# EAGLE design rs232_usb (EAGLE 6.5.0)
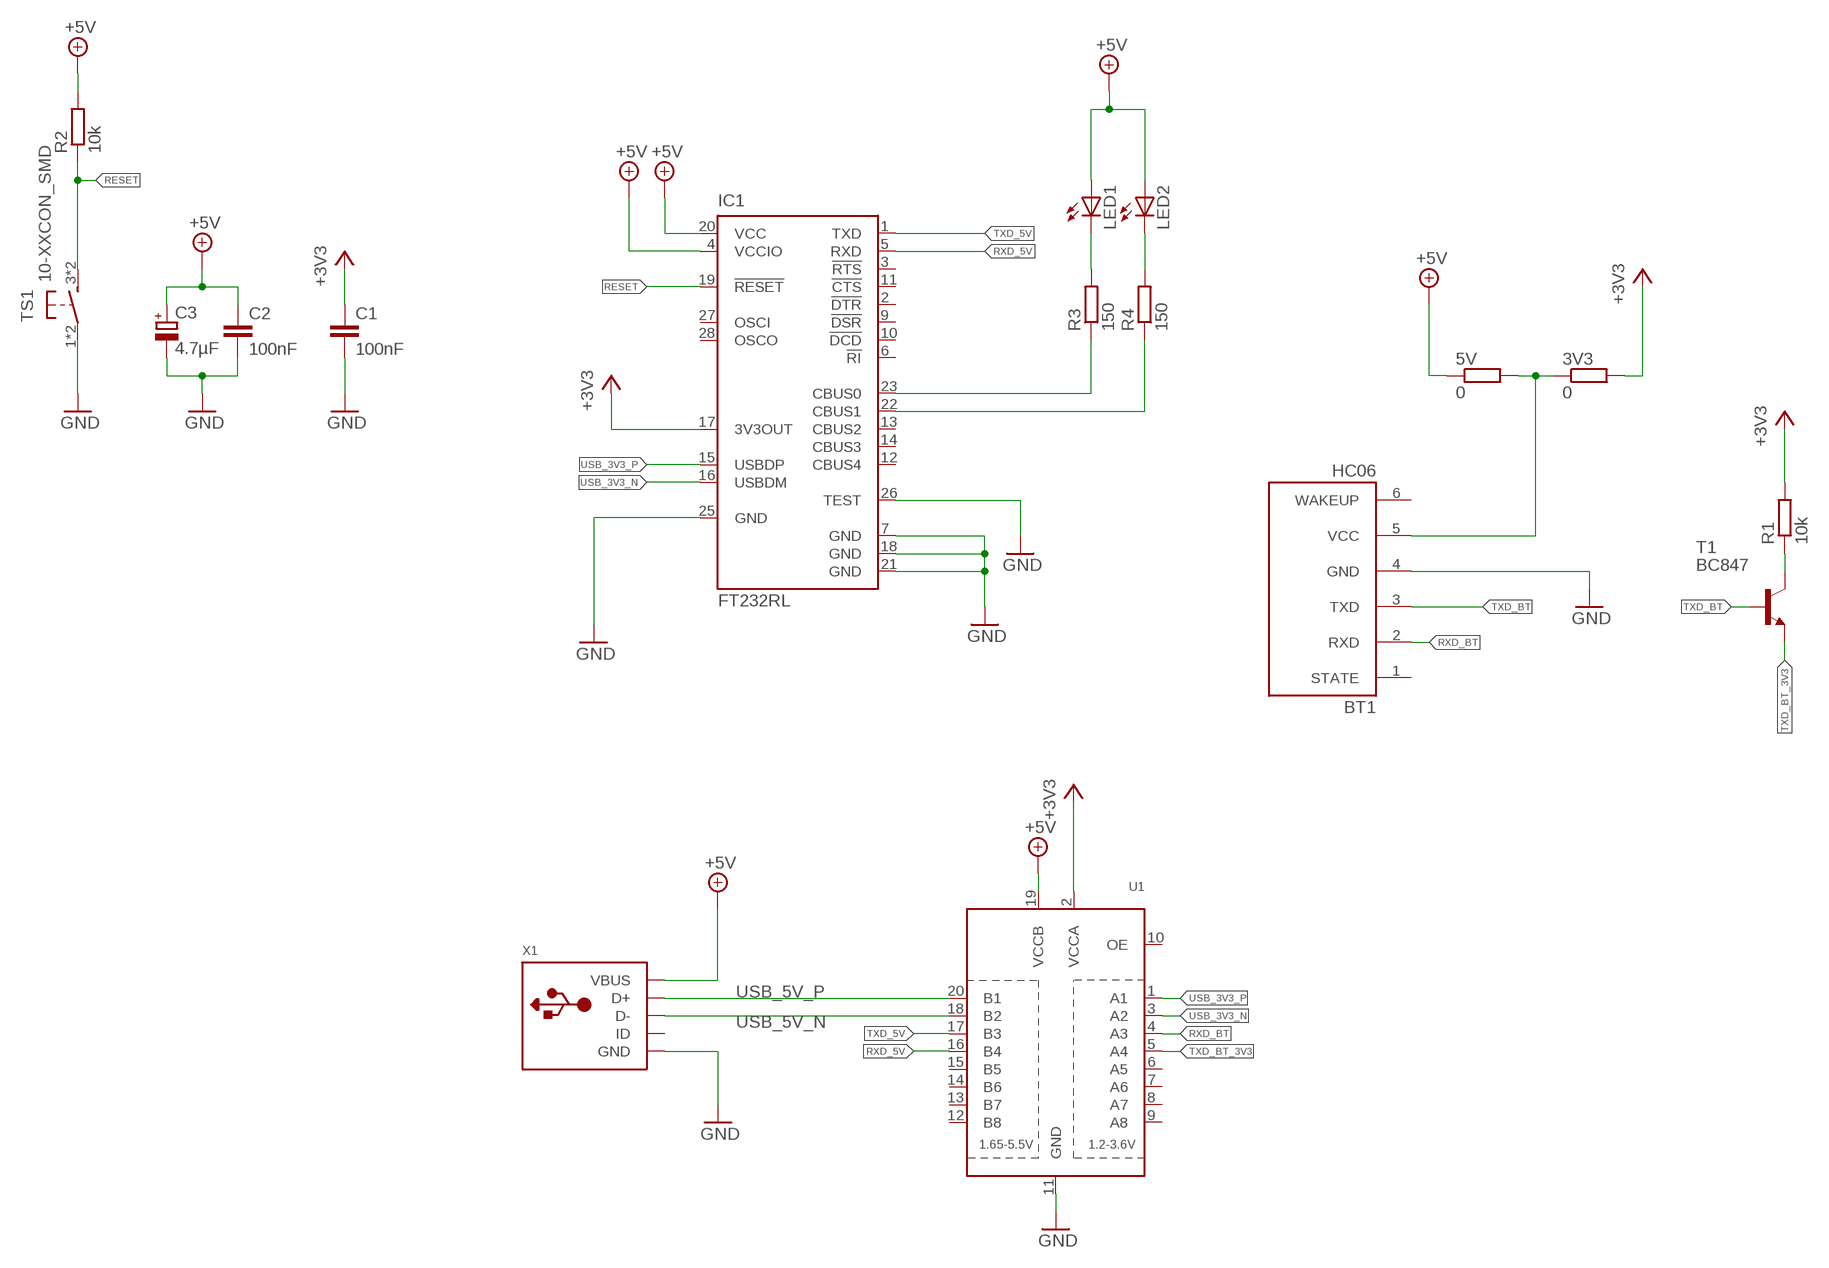
[diagram p0: schematic, sheet 1]

## Parts
3V3  0  R-EU_R0805  [R0805]
5V  0  R-EU_R0805  [R0805]
BT1  HC06  [HC06]
C1  100nF  C-EUC0805  [C0805]
C2  100nF  C-EUC0805  [C0805]
C3  4.7µF  CPOL-EUC/6032-28R  [C/6032-28R]
IC1  FT232RL  [SSOP28]
LED1  LEDCHIPLED_0805  [CHIPLED_0805]
LED2  LEDCHIPLED_0805  [CHIPLED_0805]
R1  10k  R-EU_R0805  [R0805]
R2  10k  R-EU_R0805  [R0805]
R3  150  R-EU_R0805  [R0805]
R4  150  R-EU_R0805  [R0805]
T1  BC847  [SOT23]
TS1  10-XXCON_SMD  [SKHMPXE010]
U1  TXB0108PWR  [TSSOP20]
X1  USBMINIB  [USB-MINIB]

## Nets
+3V3: 3V3.2 C1.1 IC1.17(3V3OUT) R1.2 U1.2(VCCA)
+5V: 5V.1 C2.1 C3.+ IC1.4(VCCIO) IC1.20(VCC) LED1.A LED2.A R2.2 U1.19(VCCB) X1.VBUS
GND: BT1.4(GND) C1.2 C2.2 C3.- IC1.7(GND) IC1.18(GND) IC1.21(GND) IC1.25(GND) IC1.26(TEST) TS1.1(P) TS1.2(P) U1.11(GND) X1.GND
LED1: IC1.23(CBUS0) R3.1
LED2: IC1.22(CBUS1) R4.1
N$1: 3V3.1 5V.2 BT1.5(VCC)
N$4: LED1.C R3.2
N$5: LED2.C R4.2
N$7: R1.1 T1.3(C)
RESET: IC1.19(!RESET) R2.1 TS1.3(S) TS1.4(S)
RXD_5V: IC1.5(RXD) U1.16(B4)
RXD_BT: BT1.2(RXD) U1.4(A3)
TXD_5V: IC1.1(TXD) U1.17(B3)
TXD_BT: BT1.3(TXD) T1.1(B)
TXD_BT_3V3: T1.2(E) U1.5(A4)
USB_3V3_N: IC1.16(USBDM) U1.3(A2)
USB_3V3_P: IC1.15(USBDP) U1.1(A1)
USB_5V_N: U1.18(B2) X1.D-
USB_5V_P: U1.20(B1) X1.D+
Unconnected: BT1.1(STATE) BT1.6(WAKEUP) IC1.2(!DTR) IC1.3(!RTS) IC1.6(!RI) IC1.9(!DSR) IC1.10(!DCD) IC1.11(!CTS) IC1.12(CBUS4) IC1.13(CBUS2) IC1.14(CBUS3) IC1.27(OSCI) IC1.28(OSCO) U1.6(A5) U1.7(A6) U1.8(A7) U1.9(A8) U1.10(OE) U1.12(B8) U1.13(B7) U1.14(B6) U1.15(B5) X1.ID

## Library data of the parts
3V3 5V R1-R4 = resistor:R-EU_: RESISTOR, European symbol
BT1 = 1_Robo-Lib:HC06: Bluetooth Modul HC06
C1 C2 = resistor:C-EU: CAPACITOR, European symbol
C3 = resistor:CPOL-EU: POLARIZED CAPACITOR, European symbol
IC1 = ftdichip:FT232R: Source: http://www.ftdichip.com/Documents/DataSheets/DS_FT232R_v104.pdf; MPN: FT232RL; OC_FARNELL: 1146032; OC_NEWARK: 91K9918
LED1 LED2 = adafruit:LED: LED OSRAM: - CHIPLED LG R971, LG N971, LY N971, LG Q971, LY Q971, LO R971, LY R971 LH N974, LH R974 LS Q976, LO Q976, LY Q976 LO Q996 - Hyper CHIPLED LW Q18S LB Q993, LB Q99A, LB R99A - SideLED LS A670, LO A670, LY A670, LG A670, LP A670 LB A673, LV A673, LT A673, LW A673 LH A674 LY A675 LS A676, LA A676, LO A676, LY A676, LW A676 LS A679, LY A679, LG A679 - Hyper Micro SIDELED® LS Y876, LA Y876, LO Y876, LY Y876 LT Y87S - SmartLED LW L88C, LW L88S LB L89C, LB L89S, LG L890 LS L89K, LO L89K, LY L89K LS L896, LA L896, LO L896, LY L896 - TOPLED LS T670, LO T670, LY T670, LG T670, LP T670 LSG T670, LSP T670, LSY T670, LOP T670, LYG T670 LG T671, LOG T671, LSG T671 LB T673, LV T673, LT T673, LW T673 LH T674 LS T676, LA T676, LO T676, LY T676, LB T676, LH T676, LSB T676, LW T676 LB T67C, LV T67C, LT T67C, LS T67K, LO T67K, LY T67K, LW E67C LS E67B, LA E67B, LO E67B, LY E67B, LB E67C, LV E67C, LT E67C LW T67C LS T679, LY T679, LG T679 LS T770, LO T770, LY T770, LG T770, LP T770 LB T773, LV T773, LT T773, LW T773 LH T774 LS E675, LA E675, LY E675, LS T675 LS T776, LA T776, LO T776, LY T776, LB T776 LHGB T686 LT T68C, LB T68C - Hyper Mini TOPLED® LB M676 - Mini TOPLED Santana® LG M470 LS M47K, LO M47K, LY M47K Source: http://www.osram.convergy.de/
T1 = transistor-neu-to92:BC847: NPN TRANSISTOR
TS1 = 1_Robo-Lib:10-XXCON: Switch with/without Connect-Through
U1 = adafruit:TXB0108PWR: 8-Bit Bi-Directional Level Shifter 1.2V-3.6V (VCCA) to 1.65V-5.5V (VCCB) bi-directional level shifter with auto direction sensing. Max data rate - VCCA 1.8V: 20Mbps (50ns), VCCA 3.3V: 100Mbps (10ns) Digikey: 296-21527-1-ND
X1 = adafruit:USB: USB Connectors USBMINIB - Surface Mount Female Mini-B USB Connector 4UConnector: 06564 By microbuilder.eu Thru-hole RA Female Mini-B USB Connector 4UConnector: 18732 By ladyada.net

## Board
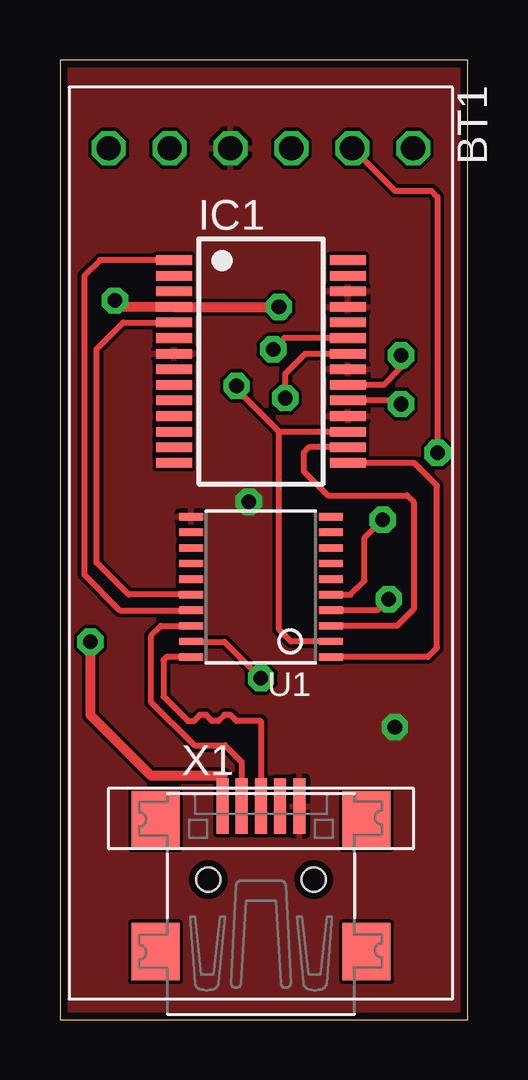
[diagram p1: board, top side]
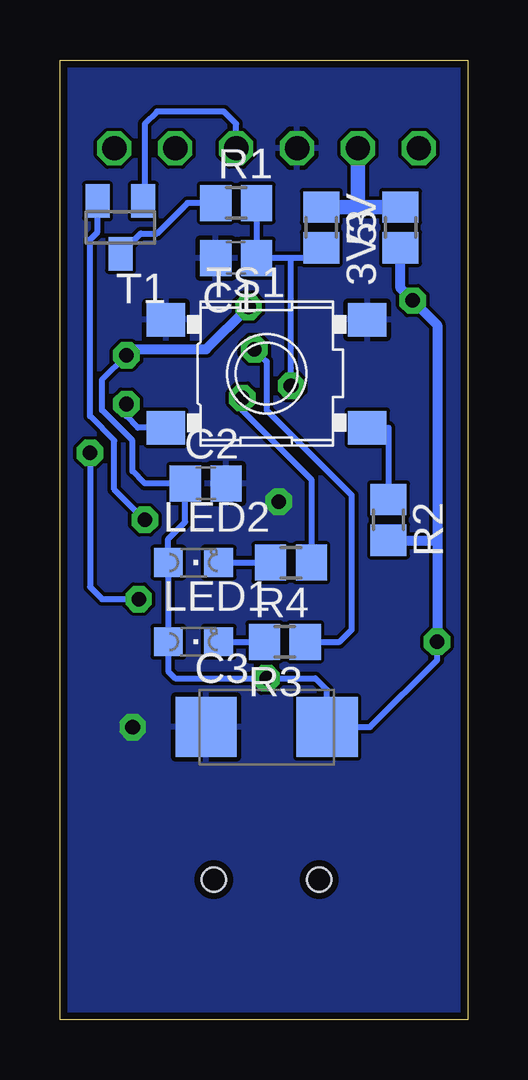
[diagram p2: board, bottom side, seen from below]

Size 17 x 40 mm. Coordinates in mm from the lower left corner, seen from the top.
Outline: 0,0 17,0 17,40 0,40 0,0
Copper layers (1*16): Top 0.035mm / dielectric 1.5mm / Bottom 0.035mm
Design rules "PCB-POOL Standard": minimum track width 0.15mm, minimum drill 0.3mm, track to track 0.15mm, track to pad 0.15mm, pad to pad 0.15mm, via to via 0.15mm, smd to smd 0.15mm, copper to edge 0.3mm, drill to drill 0.2mm, minimum pad ring 0.2mm, minimum via ring 0.15mm, stop-mask expansion 0.075mm, vias tented up to drill 0mil, thermal gap 0.2mm

### Footprints (pad centres in the part's own frame; a part is rotated, then mirrored left to right if it is on the bottom)
R0805 = smd 1.3 x 1.5: 1 -0.85,0; 2 0.85,0
HC06 = drill 1.016 octagon: 1 -6.35,0; 2 -3.81,0; 3 -1.27,0; 4 1.27,0; 5 3.81,0; 6 6.35,0
C0805 = smd 1.3 x 1.5: 1 -0.85,0; 2 0.85,0
C/6032-28R = smd 2.55 x 2.5: + 2.525,0; - -2.525,0
SSOP28 = smd 0.4 x 1.5: 1 -4.225,-3.625; 2 -3.575,-3.625; 3 -2.925,-3.625; 4 -2.275,-3.625; 5 -1.625,-3.625; 6 -0.975,-3.625; 7 -0.325,-3.625; 8 0.325,-3.625; 9 0.975,-3.625; 10 1.625,-3.625; 11 2.275,-3.625; 12 2.925,-3.625; 13 3.575,-3.625; 14 4.225,-3.625; 15 4.225,3.625; 16 3.575,3.625; 17 2.925,3.625; 18 2.275,3.625; 19 1.625,3.625; 20 0.975,3.625; 21 0.325,3.625; 22 -0.325,3.625; 23 -0.975,3.625; 24 -1.625,3.625; 25 -2.275,3.625; 26 -2.925,3.625; 27 -3.575,3.625; 28 -4.225,3.625
CHIPLED_0805 = smd 1.2 x 1.2: A 0,-1.05; C 0,1.05
SOT23 = smd 1 x 1.4: 1 -0.95,-1.1; 2 0.95,-1.1; 3 0,1.1
SKHMPXE010 = smd 1.6 x 1.4: 1 -4.2,2.25; 2 4.2,2.25; 3 -4.2,-2.25; 4 4.2,-2.25
TSSOP20 = smd 0.305 x 0.991: 1 -2.925,-2.918; 2 -2.275,-2.918; 3 -1.625,-2.918; 4 -0.975,-2.918; 5 -0.325,-2.918; 6 0.325,-2.918; 7 0.975,-2.918; 8 1.625,-2.918; 9 2.275,-2.918; 10 2.925,-2.918; 11 2.925,2.918; 12 2.275,2.918; 13 1.625,2.918; 14 0.975,2.918; 15 0.325,2.918; 16 -0.325,2.918; 17 -0.975,2.918; 18 -1.625,2.918; 19 -2.275,2.918; 20 -2.925,2.918
USB-MINIB = smd 0.5 x 2.308: D+ 0,4.064; D- -0.8,4.064; GND 1.6,4.064; ID 0.8,4.064; VBUS -1.6,4.064 | smd 2 x 2.4: GND1 -4.4,-2; GND2 -4.4,3.5; GND3 4.4,3.5; GND4 4.4,-2 | hole 1: -2.2,1; 2.2,1

### Placement (x,y rotation side)
3V3  6.1,33.02 270 bottom
5V  2.79,33.02 90 bottom
BT1  8.38,36.32 180 top
C1  9.65,31.75 180 bottom
C2  10.92,22.35 0 bottom
C3  8.38,12.19 0 bottom
IC1  8.38,27.43 270 top
LED1  11.43,15.75 270 bottom
LED2  11.43,19.05 270 bottom
R1  9.65,34.04 0 bottom
R2  3.3,20.83 270 bottom
R3  7.62,15.75 180 bottom
R4  7.37,19.05 180 bottom
T1  14.48,33.02 180 bottom
TS1  8.38,26.92 0 bottom
U1  8.38,18.03 90 top
X1  8.38,4.83 0 top

### Tracks (layer width: path | path; a pad name or v marks a point on that pad's centre or on a via)
+3V3  (via drill 0.61)
  Top 0.254: U1.2 9.64,15.76 9.14,16.26 9.14,24.51 | 9.14,24.51 IC1.17 | v7.37,26.42 7.37,26.29 9.14,24.51
  Bottom 0.254: R1.2 C1.1 7.37,31.75 | 3V3.2 6.52,31.75 7.37,31.75 | v7.37,26.42 7.37,31.75
+5V  (via drill 0.61)
  Top 0.254: U1.19 5.46,15.75 6.86,15.75 v8.38,14.22 | v9.13,29.71 9.14,29.72 | v14.22,27.69 14.22,27.18 13.5,26.46 IC1.20
  Top 0.406: X1.VBUS 6.78,10.16 3.81,10.16 1.27,12.7 v1.27,15.75 | v2.29,29.97 2.55,29.71 IC1.4 v9.13,29.71
  Bottom 0.254: v1.27,15.75 1.27,14.99 4.06,12.19 C3.+ 5.86,13.73 6.35,14.22 v8.38,14.22 12.19,14.22 12.48,14.51 LED1.A LED2.A 12.48,20.03 11.77,20.74 C2.1 13.46,22.35 13.97,22.86 13.97,24.13 15.24,25.4 15.24,26.67 v14.22,27.69 13.97,27.94 | 2.29,31.66 5V.1
  Bottom 0.406: R2.2 1.27,19.98 | 1.27,19.98 v1.27,15.75 | 13.97,27.94 10.9,27.94 v9.13,29.71 | 1.27,19.98 1.27,28.96 v2.29,29.97 2.79,30.48 5V.1
GND  (via drill 0.61)
  other vias: 13.97,12.19 7.87,21.59
  pour Top: 0,40 17,40 17,0 0,0
  pour Bottom: 0,40 17,40 17,0 0,0
LED1  (via drill 0.61)
  Top 0.254: IC1.23 9.36,28.41 v8.89,27.94
  Bottom 0.254: v8.89,27.94 8.38,27.43 8.38,25.4 4.83,21.84 4.83,16.26 5.33,15.75 R3.1
LED2  (via drill 0.61)
  Top 0.254: v9.4,25.91 9.4,26.92 10.23,27.76 IC1.22
  Bottom 0.254: v9.4,25.91 9.4,25.4 6.52,22.52 R4.1
N$1
  Bottom 0.61: BT1.5 4.57,33.87 | 4.57,33.87 3V3.1 | 4.57,33.87 5V.2
N$4
  Bottom 0.254: LED1.C R3.2
N$5
  Bottom 0.254: LED2.C R4.2
N$7
  Bottom 0.254: T1.3 13.63,32.77 12.95,32.77 11.68,34.04 R1.1
RESET  (via drill 0.61)
  Top 0.254: v14.22,25.65 14.07,25.81 IC1.19
  Bottom 0.254: TS1.4 3.3,24.67 R2.1 | TS1.3 13.75,24.67 14.22,25.15 v14.22,25.65
RXD_5V
  Top 0.254: U1.16 2.87,17.71 1.52,19.05 1.52,27.94 2.64,29.06 IC1.5
RXD_BT  (via drill 0.61)
  Top 0.254: BT1.2 13.97,34.54 15.49,34.54 15.75,34.29 v15.75,23.62 | v13.72,17.53 13.25,17.06 U1.4
  Bottom 0.254: v15.75,23.62 15.75,18.03 15.24,17.53 v13.72,17.53
TXD_5V
  Top 0.254: IC1.1 1.67,31.66 1.02,31 1.02,18.54 2.5,17.06 U1.17
TXD_BT
  Bottom 0.254: BT1.3 9.65,37.34 10.16,37.85 12.95,37.85 13.46,37.34 13.46,34.19 T1.1
TXD_BT_3V3  (via drill 0.61)
  Top 0.254: U1.5 12.12,17.71 12.7,18.29 12.7,20.07 v13.46,20.83
  Bottom 0.254: v13.46,20.83 14.73,22.1 14.73,24.13 15.75,25.15 15.75,32.51 15.43,32.83 T1.2
USB_3V3_N
  Top 0.254: U1.3 14.05,16.41 14.76,17.11 14.76,21.57 14.48,21.84 11.18,21.84 10.16,22.86 10.16,23.62 10.39,23.86 IC1.16
USB_3V3_P
  Top 0.254: U1.1 15.34,15.11 15.72,15.49 15.72,22.26 14.77,23.21 IC1.15
USB_5V_N
  Top 0.254: X1.D- 7.58,10.74 6.89,11.43 5.61,11.43 3.81,13.23 3.81,16 4.22,16.41 U1.18
USB_5V_P
  Top 0.254: U1.20 4.44,15.11 4.32,14.99 4.32,13.46 5.33,12.45 5.59,12.45 5.84,12.7 6.1,12.7 6.35,12.45 6.6,12.45 6.86,12.7 7.11,12.7 7.37,12.45 8.38,12.45 X1.D+